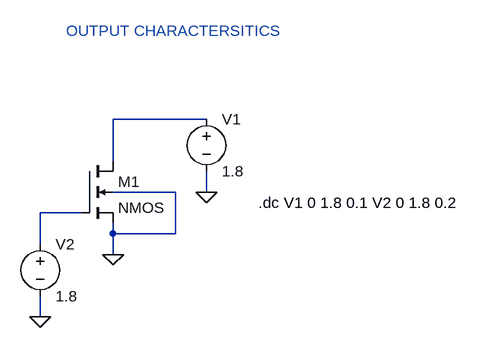
[diagram p0: schematic 9)output_charactersitics.asc]
9)output_charactersitics.asc, the LTspice schematic file:
Version 4
SHEET 1 880 680
WIRE 224 32 80 32
WIRE 80 96 80 32
WIRE 176 144 80 144
WIRE 224 144 224 112
WIRE 32 176 -32 176
WIRE 80 208 80 192
WIRE 176 208 176 144
WIRE 176 208 80 208
WIRE -32 224 -32 176
WIRE 80 240 80 208
WIRE -32 336 -32 304
FLAG 80 240 0
FLAG 224 144 0
FLAG -32 336 0
SYMBOL nmos4 32 96 R0
SYMATTR InstName M1
SYMBOL voltage 224 16 R0
WINDOW 123 0 0 Left 0
WINDOW 39 0 0 Left 0
SYMATTR InstName V1
SYMATTR Value 1.8
SYMBOL voltage -32 208 R0
WINDOW 123 0 0 Left 0
WINDOW 39 0 0 Left 0
SYMATTR InstName V2
SYMATTR Value 1.8
TEXT 304 160 Left 2 !.dc V1 0 1.8 0.1 V2 0 1.8 0.2
TEXT 8 -104 Left 2 ;OUTPUT CHARACTERSITICS

The netlist it stands for:
* 9)output_charactersitics.asc
M1 N001 N002 0 0 NMOS
V1 N001 0 1.8
V2 N002 0 1.8
.model NMOS NMOS
.model PMOS PMOS
.lib standard.mos
.dc V1 0 1.8 0.1 V2 0 1.8 0.2
* OUTPUT CHARACTERSITICS
.backanno
.end